# EAGLE design Adafruit QT2040 Trinkey (EAGLE 9.6.2)
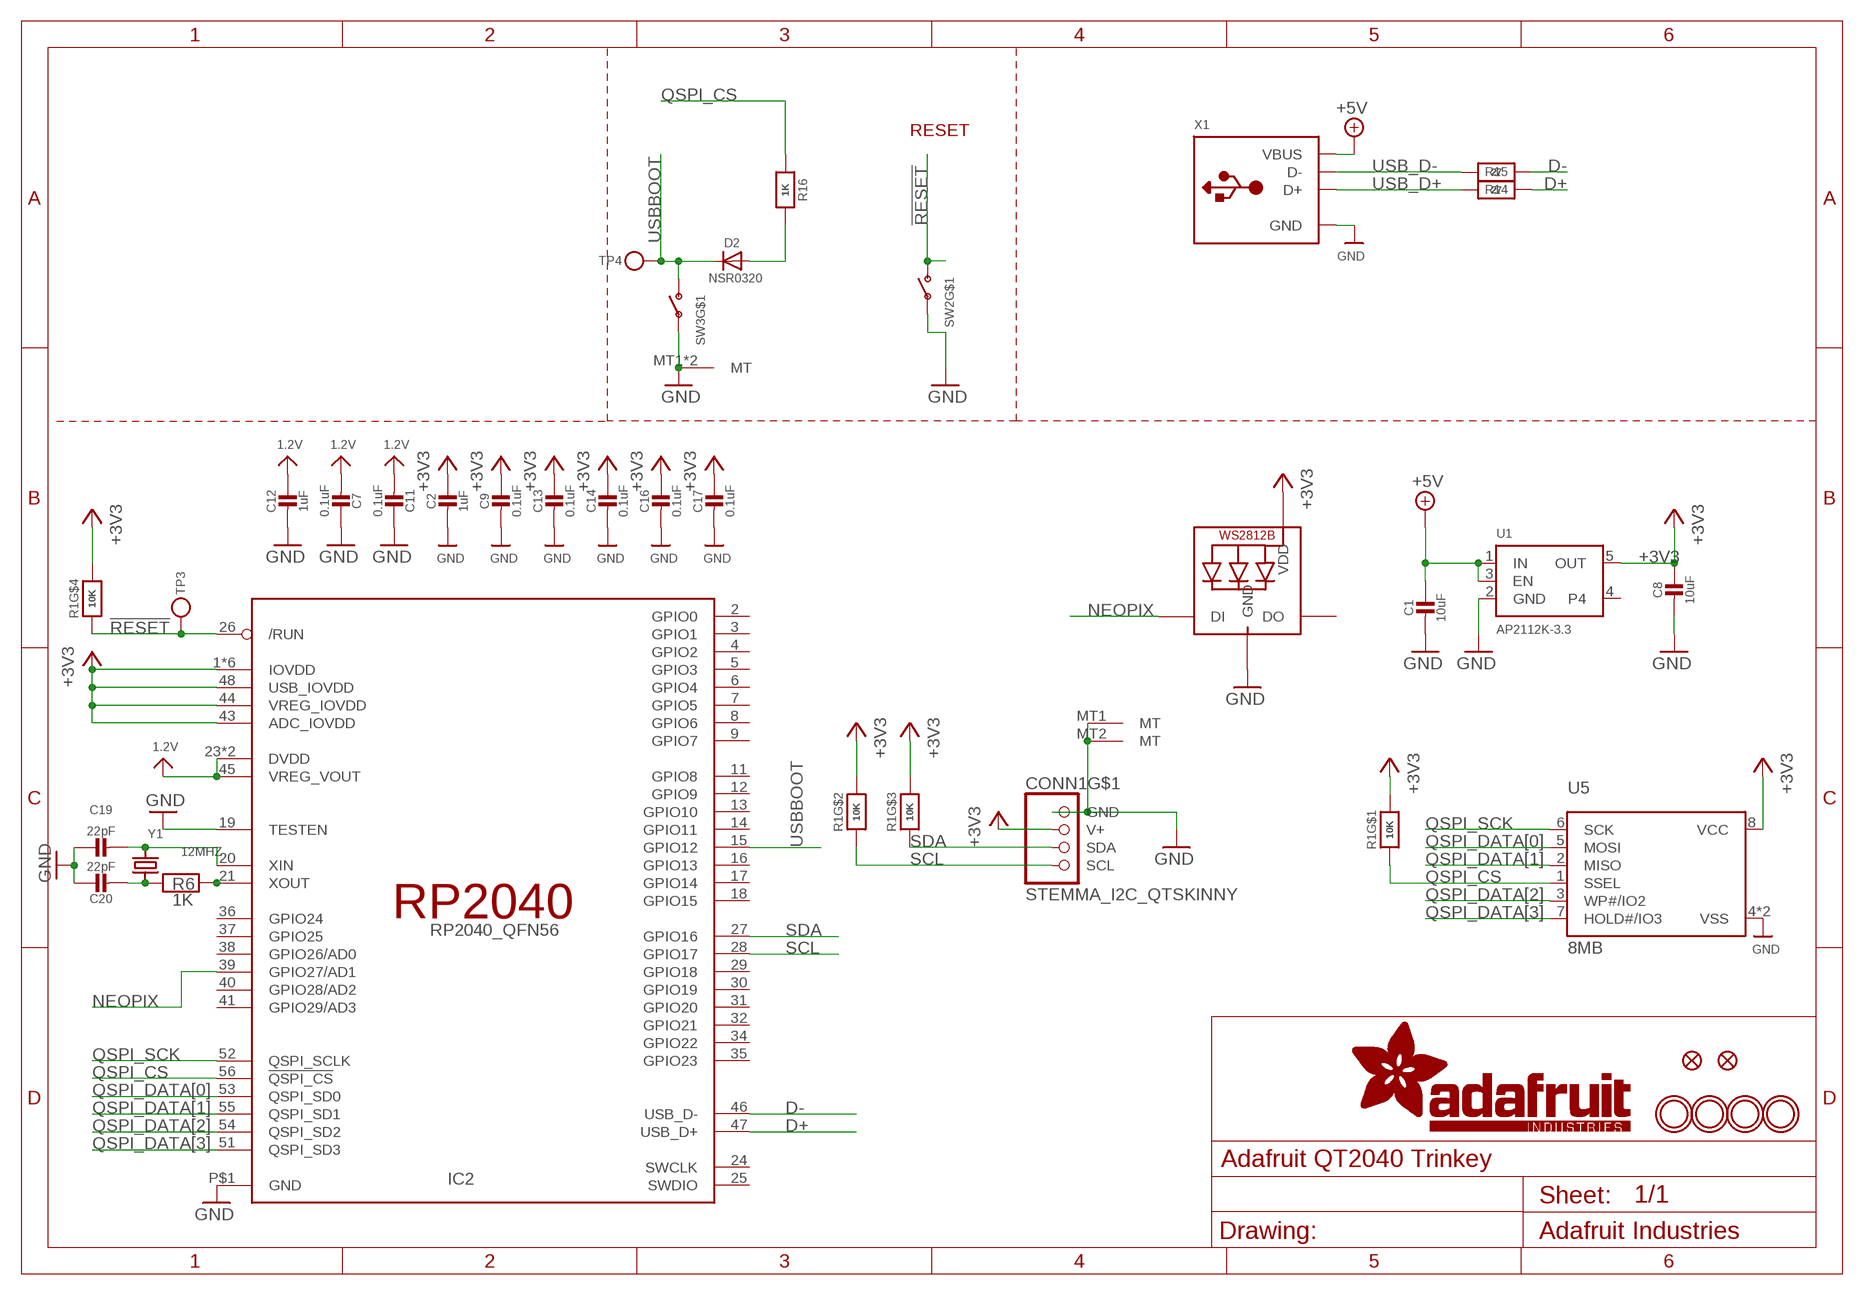
[diagram p0: schematic, sheet 1]

## Parts
C1  10uF  CAP_CERAMIC0805-NOOUTLINE  [0805-NO]
C2  1uF  CAP_CERAMIC0603_NO  [0603-NO]
C7  0.1uF  CAP_CERAMIC_0603MP  [_0603MP]
C8  10uF  CAP_CERAMIC0805-NOOUTLINE  [0805-NO]
C9  0.1uF  CAP_CERAMIC0603_NO  [0603-NO]
C11  0.1uF  CAP_CERAMIC0603_NO  [0603-NO]
C12  1uF  CAP_CERAMIC0603_NO  [0603-NO]
C13  0.1uF  CAP_CERAMIC0603_NO  [0603-NO]
C14  0.1uF  CAP_CERAMIC0603_NO  [0603-NO]
C16  0.1uF  CAP_CERAMIC0603_NO  [0603-NO]
C17  0.1uF  CAP_CERAMIC0603_NO  [0603-NO]
C19  22pF  CAP_CERAMIC0603_NO  [0603-NO]
C20  22pF  CAP_CERAMIC0603_NO  [0603-NO]
CONN1  STEMMA_I2C_QTSKINNY  [JST_SH4_SKINNY]
D2  NSR0320  DIODE_SOD323MINI  [SOD-323_MINI]
IC2  RP2040_QFN56  [QFN56_7MM_REDUCEDEPAD]
LED1  WS2812B_SK6805_1515  [SK6805_1515]
R1  10K  RESISTOR_4PACK  [RESPACK_4X0603]
R6  1K  RESISTOR_0603_NOOUT  [0603-NO]
R14  27  RESISTOR_0603_NOOUT  [0603-NO]
R15  27  RESISTOR_0603_NOOUT  [0603-NO]
R16  1K  RESISTOR_0603_NOOUT  [0603-NO]
SW2  SWITCH_SPST_TACT_RA  [SPST_TACTILE_RA]
SW3  SWITCH_SPST_TACT_RA  [SPST_TACTILE_RA]
TP3  TESTPOINTROUND1.5MMNO  [TESTPOINT_ROUND_1.5MM_NO]
TP4  TESTPOINTROUND1.5MMNO  [TESTPOINT_ROUND_1.5MM_NO]
U1  AP2112K-3.3  VREG_SOT23-5  [SOT23-5]
U5  8MB  SPIFLASH_8PIN_4X4  [USON8_4X4]
U$1  MOUNTINGHOLE2.5  [MOUNTINGHOLE_2.5_PLATED]
U$2  MOUNTINGHOLE2.5  [MOUNTINGHOLE_2.5_PLATED]
U$4  MOUNTINGHOLE2.5  [MOUNTINGHOLE_2.5_PLATED]
U$5  MOUNTINGHOLE2.5  [MOUNTINGHOLE_2.5_PLATED]
U$6  FIDUCIAL_1MM  [FIDUCIAL_1MM]
U$8  FIDUCIAL_1MM  [FIDUCIAL_1MM]
X1  USB_TYPEAPCB  [USBA_PCB]
Y1  12MHZ  CRYSTAL2.5X2.0  [CRYSTAL_2.5X2]

## Nets
1.2V: C7.2 C11.2 C12.1 IC2.23(DVDD) IC2.45(VREG_VOUT) IC2.50(DVDD)
!RESET: IC2.26(/RUN) R1.4 SW2.2(S) TP3.P$1
+3V3: C2.1 C8.1 C9.1 C13.1 C14.1 C16.1 C17.1 CONN1.2(V+) IC2.1(IOVDD) IC2.10(IOVDD) IC2.22(IOVDD) IC2.33(IOVDD) IC2.42(IOVDD) IC2.43(ADC_IOVDD) IC2.44(VREG_IOVDD) IC2.48(USB_IOVDD) IC2.49(IOVDD) LED1.2(VDD) R1.5 R1.6 R1.7 R1.8 U1.5(OUT) U5.8(VCC)
+5V [power]: C1.1 U1.1(IN) U1.3(EN) X1.VCC(VBUS)
D+: IC2.47(USB_D+) R15.2
D-: IC2.46(USB_D-) R14.2
GND [power]: C1.2 C2.2 C7.1 C8.2 C9.2 C11.1 C12.2 C13.2 C14.2 C16.2 C17.2 C19.1 C20.1 CONN1.1(GND) CONN1.MT1(MT) CONN1.MT2(MT) IC2.19(TESTEN) IC2.P$1(GND) LED1.4(GND) SW2.1(P) SW3.1(P) SW3.MT1(MT) SW3.MT2(MT) U1.2(GND) U5.4(VSS) U5.PAD(VSS) X1.GND
N$1: D2.A R16.2
N$5: C19.2 IC2.20(XIN) Y1.3
N$6: C20.2 R6.1 Y1.1
N$7: IC2.21(XOUT) R6.2
NEOPIX: IC2.39(GPIO27/AD1) LED1.1(DI)
QSPI_CS: IC2.56(!QSPI_CS) R1.1 R16.1 U5.1(SSEL)
QSPI_DATA[0]: IC2.53(QSPI_SD0) U5.5(MOSI)
QSPI_DATA[1]: IC2.55(QSPI_SD1) U5.2(MISO)
QSPI_DATA[2]: IC2.54(QSPI_SD2) U5.3(WP#/IO2)
QSPI_DATA[3]: IC2.51(QSPI_SD3) U5.7(HOLD#/IO3)
QSPI_SCK: IC2.52(QSPI_SCLK) U5.6(SCK)
SCL: CONN1.4(SCL) IC2.28(GPIO17) R1.2
SDA: CONN1.3(SDA) IC2.27(GPIO16) R1.3
USB_D+: R15.1 X1.USB_PLUS(D+)
USB_D-: R14.1 X1.USB_NEG(D-)
USBBOOT: D2.C IC2.15(GPIO12) SW3.2(S) TP4.P$1
Unconnected: IC2.2(GPIO0) IC2.3(GPIO1) IC2.4(GPIO2) IC2.5(GPIO3) IC2.6(GPIO4) IC2.7(GPIO5) IC2.8(GPIO6) IC2.9(GPIO7) IC2.11(GPIO8) IC2.12(GPIO9) IC2.13(GPIO10) IC2.14(GPIO11) IC2.16(GPIO13) IC2.17(GPIO14) IC2.18(GPIO15) IC2.24(SWCLK) IC2.25(SWDIO) IC2.29(GPIO18) IC2.30(GPIO19) IC2.31(GPIO20) IC2.32(GPIO21) IC2.34(GPIO22) IC2.35(GPIO23) IC2.36(GPIO24) IC2.37(GPIO25) IC2.38(GPIO26/AD0) IC2.40(GPIO28/AD2) IC2.41(GPIO29/AD3) LED1.3(DO) SW2.MT1(MT) SW2.MT2(MT) U1.4

## Notes on the sheet
- RESET

## Library data of the parts
C1 C2 C7-C9 C11-C14 C16 C17 C19 C20 = microbuilder:CAP_CERAMIC: Ceramic Capacitors For new designs, use the packages preceded by an '_' character since they are more reliable: The following footprints should be used on most boards: _0402 - Standard footprint for regular board layouts _0603 - Standard footprint for regular board layouts _0805 - Standard footprint for regular board layouts _1206 - Standard footprint for regular board layouts For extremely tight-pitch boards where space is at a premium, the following 'micro-pitch' footprints can be used (smaller pads, no silkscreen outline, etc.): _0402MP - Micro-pitch footprint for very dense/compact boards _0603MP - Micro-pitch footprint for very dense/compact boards _0805MP - Micro-pitch footprint for very dense/compact boards _1206MP - Micro-pitch footprint for very dense/compact boards
CONN1 = microbuilder:STEMMA_I2C
D2 = microbuilder:DIODE: Diode SMA Model Volts Amps Type Vf Ir Digikey # Notes SSA34-E3 40V 3A Schottky 480mV @ 3A 200uA @ 40V SSA34-E3/61TGITR-ND CDBA120-G 20V 1A Schottky 500mV @ 1A 500uA @ 20V 641-1014-6-ND REEL MBRA210 10V 2A Schottky 350mV @ 2A 700uA @ 10V MBRA210LT3 SOD-123 Model Volts Amps Type Vf Ir Order # Notes BAT54T1G 30V 200mA Schottky 800mV @ 200mA 2uA @ 25V BAT54T1GOSTR-ND B0530W 30V 500mA Schottky 430mV @ 500mA 130uA @ 30V B0530W-FDICT-ND REEL MBR120 20V 1A Schottky 340mV @ 1A MBR120VLSFT1GOSCT-ND SOD-323 Model Volts Amps Type Vf Ir Order # Notes PMEG2005EJ 20V 500mA Schottky 355mV @ 500mA 568-4110-1-ND ZLLS410 10V 570mA Schottky 380mV @ 570mA ZLLS410CT-ND 1N4148WS 75V 150mA Silicon/Simple 1V 1N4148WSFSCT-ND REEL SOD-523 Model Volts Amps Type Vf Ir Order # Notes BAT54XV2 30V 200mA Schottky 0.8V @ 100mA BAT54XV2CT-ND TB751S 30V 30mA Schottky RB751S-40TE61CT-ND SOT23-R/W (R = Solder Paste/Reflow Ovens, W = Hand-Soldering) Model Volts Amps Type Vf Ir Order # Notes BAT54FILM 40V 300mA Schottky 497-7162-1-ND POWERDI-5 Model Volts Amps Type Vf Ir Order # Notes PDS560 60V 5A Schottky 670mV @ 5A 150uA @ 60V PDS560DICT-ND
IC2 = adafruit_micro:RP2040
LED1 = microbuilder:WS2812B
R1 = microbuilder:RESISTOR_4PACK: Resistor Packs (4 resistors) 4 x 0603 10K 1/16W - Digikey: YC164J-10KCT-ND
R6 R14-R16 = microbuilder:RESISTOR: Resistors For new designs, use the packages preceded by an '_' character since they are more reliable: The following footprints should be used on most boards: _0402 - Standard footprint for regular board layouts _0603 - Standard footprint for regular board layouts _0805 - Standard footprint for regular board layouts _1206 - Standard footprint for regular board layouts For extremely tight-pitch boards where space is at a premium, the following 'micro-pitch' footprints can be used (smaller pads, no silkscreen outline, etc.): _0402MP - Micro-pitch footprint for very dense/compact boards _0603MP - Micro-pitch footprint for very dense/compact boards _0805MP - Micro-pitch footprint for very dense/compact boards _1206MP - Micro-pitch footprint for very dense/compact boards
SW2 SW3 = adafruit_electromech:SWITCH_SPST: Switch - SPST 4UCon 19192 (6.7x2.6mm SMT)
TP3 TP4 = microbuilder:TESTPOINT: Test Point Various test points for characterisation and PCB testing TESTPOINT_SMT - Compact Surface Mount Test Point [Digikey: 5016KTR-ND]
U1 = adafruit_power:VREG_SOT23-5: SOT23-5 Fixed Voltage Regulators Part Current Out V Out V In V Dropout θJA (°C/W) TJ (°C) Digikey Part No. ADP121 150mA 3.3V 3.4-5.5V 0.09V @ 150mA -- -- ADP121-AUJZ33R7CT-ND ADP121 150mA 3.0V 3.1-5.5V 0.09V @ 150mA -- -- ADP121-AUJZ30R7CT-ND ADP122 300mA 3.3V 3.4-5.5V 0.085V @ 300mA -- -- ADP122AUJZ-3.3-R7CT-ND ADP1712 300mA 3.3V 3.5-5.5V 0.17V @ 300mA -- -- ADP1712AUJZ-3.3-R7TR-ND AP7311 (Low Cost) 150mA 3.3V 3.5-6V 0.15V @ 150mA -- -- AP7311-33WG-7DICT-ND LD39015M18R 150mA 1.8V 1.9V-5.5V 0.08V @ 100mA -- -- 497-6977-1-ND LP2985A-33DBVR 150mA 3.3V 3.3-16V 0.28V @ 150mA 206 150 296-18479-1-ND MCP1824T-3302E/OT 300mA 3.3V 3.5V-6V 0.2V @ 300mA -- -- MCP1824T-3302E/OTCT-ND MIC5205-2.5YM5 TR 150mA 2.5V 2.7-16V 0.165V @ 150mA -- -- 576-1257-2-ND MIC5205-3.0YM5 TR 150mA 3.0V 3.2V-16V 0.165V @ 150mA -- -- 576-1258-2-ND MIC5205-3.3YM5 TR 150mA 3.3V 3.5V-16V 0.165V @ 150mA -- -- 576-1259-2-ND TPS780330220 150mA 3.3V+2.2V 3.6-5.5V 250mV Max -- -- 296-23332-1-ND TDA3663/N1,135 100mA 3.3V 3.5-45V 0.18V @ 50mA -- -- 568-5343-1-ND Max operating temp can be calculated using θJA, TJ (max junction temperature), and power in watts. Set the "Maximum Ambient Temperature" until it reaches TJ ("Max Junction Temperature"), which is the absolute limit for safe use of the regulator: Heat Sink Temperature Calculator <http://www.daycounter.com/Calculators/Heat-Sink-Temperature-Calculator.phtml> For example, With 12V source into a 3.3V LP2985 and a 30mA load, we are dissipating (12V-3.3V) * 0.03A = 0.261W. With a θJA of 206 °C/W, a TJ of 150°C, and 261mW we can safely use the chip without a heat sink up to 75°C (=147.1°C Junction Temperature).
U5 = microbuilder:SPIFLASH_8PIN: SOIC8 SPI Flash Be careful with the size since SOIC8 flash comes in several 'widths' SOIC8 150 mil M25P16 - 16Mbit (2Mbit x 8) Serial Flash (75MHz SPI Bus), Supply: 2.7-3.6V Digikey: SOIC8 - M25P16-VMN6P-ND SOIC8 208 mil W25Q16BVSSIG - 16Mbit (2Mbit x 8) Serial Flash (104MHz SPI Bus), Supply: 2.7-3.6V Digikey: SOIC8 - W25Q16BVSSIG-ND
U$1 U$2 U$4 U$5 = adafruit_electromech:MOUNTINGHOLE: Mounting Hole For #2 screws (0.086"/2.18mm width, 0.094"/2.4mm hole) use 2.5mm; BOM: EXCLUDE
U$6 U$8 = microbuilder:FIDUCIAL: Fiducial Alignment Points Various fiducial points for machine vision alignment.; BOM: EXCLUDE
X1 = adafruit_electromech:USB_TYPEA: USB - Type A Connectors Male types stick out and are inserted into a PC or matching females parts (these are the connectors used on USB Memory Sticks, etc.). Female parts are generally used for USB Host and accept a male-type connector. SMT - 4UCON: 10017 PTHFML - Digikey: 609-1045-ND, 4UCon: 05241 PCB - Use 2.0mm thick PCBs with this footprint
Y1 = microbuilder:CRYSTAL: Crystals HC49UP - Surface Mount Crystal 4.0MHz 18pF +/-30ppm Surface Mount Crystal [Digikey: 535-9857-1-ND] 12.0 MHz Surface Mount Crystal [Digikey: 535-9869-6-ND] 25.0 MHz Surface Mount Crystal [Digikey: 535-9078-1-ND] 2.5 x 2.0mm - MEMs SMT Crystal 16.0 MHz 10pF 20ppm 2.5 x 2.0mm Crystal [Digikey -40-85°C: 535-10923-1-ND] 3.2 x 2.5mm - MEMs SMT Crystal 12.0 MHz 8pF 15ppm 3.2 x 2.5mm Crystal [Digikey: -10-70°C: 644-1047-1-ND -40-125°C: 644-1128-1-ND] 40~85°C cheaper: 644-1173-6-ND 16.0 MHz 8pF 15ppm 3.2 x 2.5mm Crystal [Digikey: -10-70°C: 644-1049-1-ND -40-125°C: 644-1129-2-ND]-40~85°C cheaper: 644-1175-6-ND 16.0 MHz 10pF 10ppm 3.2 x 2.5mm Crystal [Digikey: 644-1100-1-ND] 27.12 MHz 18pF 30ppm 3.2 x 2.5mm Crystal [Digikey: 887-1424-1-ND] 27.12MHz 10pF 10ppm 3.2 x 2.5mm Crystal [Digikey: 887-1329-1-ND] 4.9 x 1.8mm - MEMs SMT Crystal 32.768 KHz 12.5pF 20ppm 4.9 x 1.8mm Crystal [Digikey: SE2415CT-ND] 8.0 x 3.8mm - Surface Mount Crystal 32.768kHz 12.5pF 20ppm -40°C-85°C [Digikey: 535-9166-2-ND] Cylinder 32.768KHz Cylinder Crystal (2x6mm body) [Ex. Digikey: 300-8341-2-ND]

## Net classes
1 power: width 0.305 mm
2 gnd: width 0.254 mm

## Board
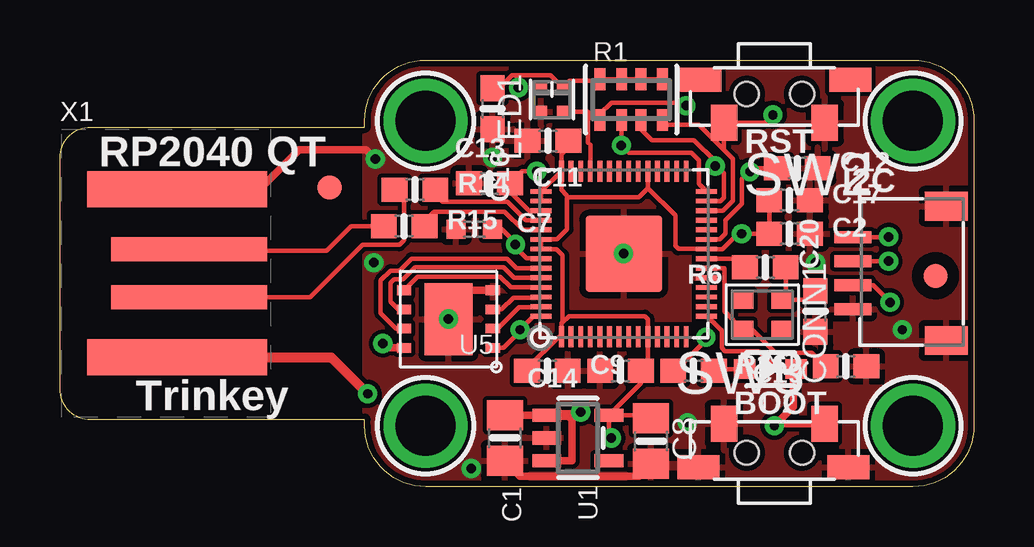
[diagram p1: board, top side]
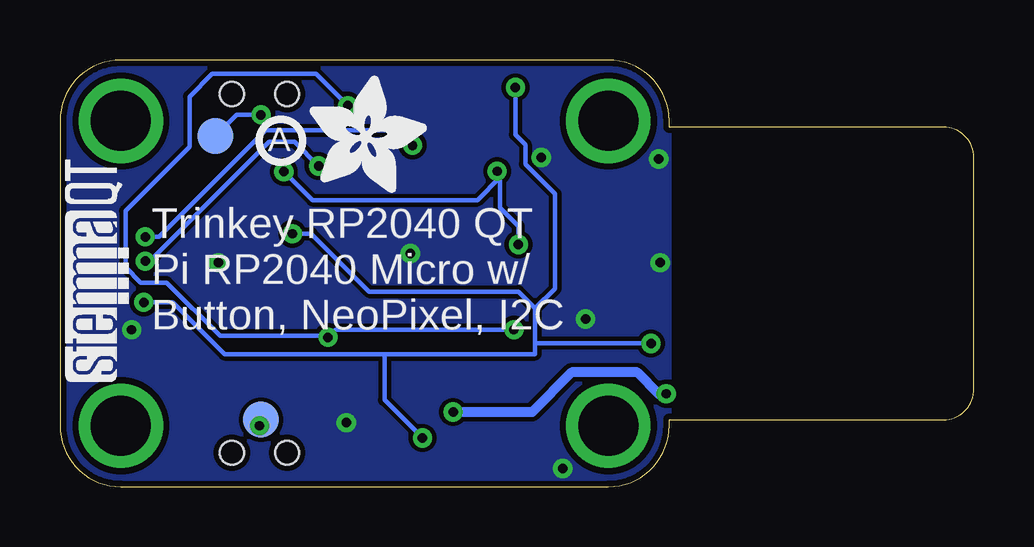
[diagram p2: board, bottom side, seen from below]

Size 38.1 x 17.78 mm. Coordinates in mm from the lower left corner, seen from the top.
Outline: 15.24,17.78 35.56,17.78 arc-90 38.1,15.24 38.1,2.54 arc-90 35.56,0 15.24,0 arc-90 12.7,2.54 12.7,2.79 1.27,2.79 arc-90 0,4.06 0,13.72 arc-90 1.27,14.99 12.7,14.99 12.7,15.24 arc-90 15.24,17.78
Copper layers (1*16): Top 0.035mm / dielectric 1.5mm / Bottom 0.035mm
Design rules "adafruit 7-7": minimum track width 7mil, minimum drill 15.5mil, track to track 7mil, track to pad 7mil, pad to pad 7mil, via to via 7mil, smd to smd 7mil, copper to edge 10mil, drill to drill 8mil, minimum pad ring 10mil, minimum via ring 8mil, stop-mask expansion 2mil, vias tented up to drill 20mil, thermal gap 10mil

### Footprints (pad centres in the part's own frame; a part is rotated, then mirrored left to right if it is on the bottom)
0805-NO = smd 1.24 x 1.5: 1 -0.95,0; 2 0.95,0
0603-NO = smd 1.075 x 1: 1 -0.85,0; 2 0.85,0
_0603MP = smd 0.8 x 0.8: 1 -0.762,0; 2 0.762,0
JST_SH4_SKINNY = smd 0.5 x 1.55: 1 -1.5,2.514; 2 -0.5,2.514; 3 0.5,2.514; 4 1.5,2.514 | smd 1.2 x 1.8: MT1 -2.8,-1.386; MT2 2.8,-1.386
SOD-323_MINI = smd 0.9 x 0.8: A 1.07,0; C -1.07,0
QFN56_7MM_REDUCEDEPAD = smd 0.875 x 0.2: 1 -3.45,2.6; 2 -3.45,2.2; 3 -3.45,1.8; 4 -3.45,1.4; 5 -3.45,1; 6 -3.45,0.6; 7 -3.45,0.2; 8 -3.45,-0.2; 9 -3.45,-0.6; 10 -3.45,-1; 11 -3.45,-1.4; 12 -3.45,-1.8; 13 -3.45,-2.2; 14 -3.45,-2.6; 29 3.45,-2.6; 30 3.45,-2.2; 31 3.45,-1.8; 32 3.45,-1.4; 33 3.45,-1; 34 3.45,-0.6; 35 3.45,-0.2; 36 3.45,0.2; 37 3.45,0.6; 38 3.45,1; 39 3.45,1.4; 40 3.45,1.8; 41 3.45,2.2; 42 3.45,2.6 | smd 0.2 x 0.875: 15 -2.6,-3.45; 16 -2.2,-3.45; 17 -1.8,-3.45; 18 -1.4,-3.45; 19 -1,-3.45; 20 -0.6,-3.45; 21 -0.2,-3.45; 22 0.2,-3.45; 23 0.6,-3.45; 24 1,-3.45; 25 1.4,-3.45; 26 1.8,-3.45; 27 2.2,-3.45; 28 2.6,-3.45; 43 2.6,3.45; 44 2.2,3.45; 45 1.8,3.45; 46 1.4,3.45; 47 1,3.45; 48 0.6,3.45; 49 0.2,3.45; 50 -0.2,3.45; 51 -0.6,3.45; 52 -1,3.45; 53 -1.4,3.45; 54 -1.8,3.45; 55 -2.2,3.45; 56 -2.6,3.45 | smd 3.2 x 3.2: P$1 0,0
SK6805_1515 = smd 0.5 x 0.5: 1 -0.5,-0.45; 2 0.5,-0.45; 3 0.5,0.45; 4 -0.5,0.45
RESPACK_4X0603 = smd 0.45 x 0.9: 1 -1.3,-0.85; 2 -0.4,-0.85; 3 0.4,-0.85; 4 1.3,-0.85; 5 1.3,0.85; 6 0.4,0.85; 7 -0.4,0.85; 8 -1.3,0.85
SPST_TACTILE_RA = smd 1.1 x 1.5: 1 -2.1,0.9; 2 2.1,0.9 | smd 1.75 x 1: MT1 -3.175,-0.9; MT2 3.075,-0.9 | hole 1: -1.15,-0.3; 1.15,-0.3
TESTPOINT_ROUND_1.5MM_NO = smd 1.5 x 1.5: P$1 0,0
SOT23-5 = smd 0.55 x 1.2: 1 -0.95,-1.3; 2 0,-1.3; 3 0.95,-1.3; 4 0.95,1.3; 5 -0.95,1.3
USON8_4X4 = smd 0.6 x 0.4: 1 -1.85,1.2; 2 -1.85,0.4; 3 -1.85,-0.4; 4 -1.85,-1.2; 5 1.85,-1.2; 6 1.85,-0.4; 7 1.85,0.4; 8 1.85,1.2 | smd 2 x 3: PAD 0,0
MOUNTINGHOLE_2.5_PLATED = drill 2.5 pad 3.2: P$1 0,0
FIDUCIAL_1MM = smd 1 x 1: 1 0,0
USBA_PCB = smd 7.5 x 1.5: GND -0.2,3.5; VCC -0.2,-3.5 | smd 6.5 x 1: USB_NEG 0.3,-1; USB_PLUS 0.3,1
CRYSTAL_2.5X2 = smd 0.9 x 0.75: 1 -0.825,-0.625; 2 0.825,-0.625; 3 0.825,0.625; 4 -0.825,0.625

### Placement (x,y rotation side)
C1  18.54,2.03 270 top
C2  30.42,10.54 0 top
C7  17.27,10.73 0 top
C8  24.64,1.91 270 top
C9  20.32,4.83 0 top
C11  17.91,12.64 0 top
C12  30.73,13.27 0 top
C13  20.35,14.41 180 top
C14  23.37,4.83 180 top
C16  18.03,15.75 270 top
C17  30.42,11.94 0 top
C19  32.77,5.02 180 top
C20  31.5,7.3 90 top
CONN1  35.56,8.89 90 top
D2  29.62,4.9 180 top
IC2  23.51,9.7 90 top
LED1  20.51,16.13 90 top
R1  23.81,16.13 0 top
R6  29.4,9.14 180 top
R14  14.8,12.38 0 top
R15  14.35,10.86 0 top
R16  26.42,4.83 0 top
SW2  29.78,16.07 180 top
SW3  29.78,1.71 0 top
TP3  31.62,14.61 270 bottom
TP4  29.72,2.79 270 bottom
U1  21.59,2.03 270 top
U5  16.19,6.99 180 top
U$1  15.24,15.24 0 top
U$2  15.24,2.54 0 top
U$4  35.56,2.54 0 top
U$5  35.56,15.24 0 top
U$6  36.5,8.79 270 top
U$7  [STEMMAQT]  35.24,4.38 90 bottom
U$8  11.24,12.46 90 top
U$9  [PCBFEAT-REV-040]  28.89,14.41 0 bottom
U$10  [ADAFRUIT_5MM]  27.69,12.26 0 bottom
X1  5.08,8.89 0 top
Y1  29.27,7.18 180 top

### Tracks (layer width: path | path; a pad name or v marks a point on that pad's centre or on a via)
1.2V  (via drill 0.39)
  Top 0.178: C7.2 18.42,10.73 18.99,10.17 v18.99,10.1 18.99,9.98 19.44,9.53 20.04,9.53 IC2.50 | IC2.45 19.55,11.5 19.54,11.5 18.76,12.28 C11.2 19.27,13.14 v19.88,13.14 | IC2.23 27.52,10.3 27.75,10.53 27.75,11.11 28.42,11.79 28.42,12.83 28.87,13.27 C12.1 28.91,13.27 v28.77,13.12
  Bottom 0.178: v28.77,13.12 27.58,11.94 20.7,11.94 19.75,12.89 | v19.88,13.14 19.75,13.27 19.75,12.89 | v18.99,10.1 18.99,10.86 19.75,11.62 19.75,12.89
!RESET  (via drill 0.39)
  Top 0.178: 27.68,14.04 26.64,15.09 25.3,15.09 R1.4 | IC2.26 27.63,11.5 28.05,11.92 28.05,13.61 28.05,13.67 27.68,14.04 | 27.68,14.04 SW2.2 29.39,15.17 v29.72,15.49
  Bottom 0.178: v29.72,15.49 30.73,15.49 TP3.P$1
+3V3  (via drill 0.39)
  Top 0.178: IC2.44 IC2.43 IC2.42 | IC2.33 24.51,12.45 | IC2.42 20.91,12.37 21.15,12.13 | 24.51,12.45 24.13,12.07 21.21,12.07 21.15,12.13 | R1.5 R1.6 R1.7 R1.8 22.45,16.91 21.25,16.91 LED1.2 20.45,17.15 18.99,17.15 | U1.5 24.22,4.31 C14.1 24.41,4.83 24.51,4.92 IC2.10 24.51,6.99 24.38,7.11 21.21,7.11 20.91,6.81 IC2.1 20.79,6.25 19.47,4.93 C9.1 | U1.5 24.51,2.98 C8.1 | 20.95,6.86 20.95,9.65 20.7,9.9 IC2.49 IC2.48 20.72,10.3 21.14,10.73 21.14,12.13 21.15,12.13 | 24.51,12.45 25.65,11.3 25.65,10.03 25.78,9.91 IC2.22 27.62,9.9 28.26,10.54 v28.42,10.54 C2.1 C17.1 | CONN1.2 33.9,8.39 v34.61,7.68 | v22.99,2.03 22.89,2.03 U1.5 | IC2.42 20.91,13.86 21.2,14.15 C13.1 | C16.1 18.31,16.6 18.85,17.15 18.99,17.15 | 18.99,17.15 19.11,17.02 v19.11,16.64
  Top 0.305: U5.8 13.65,5.79 v13.46,5.97
  Bottom 0.178: v34.61,7.68 33.4,7.68 31.24,5.53 24.57,5.53 | 24.57,5.53 18.29,5.53 18.29,5.97 | v13.46,5.97 18.29,5.97 | v28.42,10.54 27.62,10.54 25.21,8.13 18.99,8.13 18.29,7.43 | 18.29,7.43 18.29,5.97 | 24.57,5.53 24.57,3.62 v22.99,2.03 | v19.11,16.64 19.11,14.67 18.7,14.26 18.7,13.44 17.46,12.2 17.46,8.26 18.29,7.43
+5V  (via drill 0.39)
  Top 0.305: C1.1 U1.1 20.89,2.98 21.15,2.98 21.34,2.79 21.34,1.08 U1.3
  Top 0.406: X1.VCC 11.31,5.39 v12.83,3.87 | v21.71,3.11 21.58,2.98 20.89,2.98
  Bottom 0.406: v12.83,3.87 13.14,3.87 14.03,4.76 16.77,4.76 18.41,3.11 v21.71,3.11
D+
  Top 0.178: IC2.47 19.3,10.7 18.53,11.46 15.59,11.46 15.2,11.07 R15.2
D-
  Top 0.178: IC2.46 19.42,11.1 18.66,11.87 15.94,11.87 15.62,12.26 R14.2
GND  (via drill 0.39)
  Top 0.305: v13.14,13.65 12.76,14.03 9.97,14.03 8.33,12.39 X1.GND | C1.2 19.18,0.45 24.13,0.45 C8.2 | U5.4 16.57,8.19 16.19,7.81 U5.PAD
  other vias: 23.49,9.72 26.16,2.67 35.12,6.54 18.03,13.72 17.14,0.76 31.5,9.33 16.19,6.99 13.08,9.33
  pour Top: 12.7,17.78 38.1,17.78 38.1,0 12.7,0
  pour Bottom: 12.7,17.78 38.1,17.78 38.1,0 12.7,0
N$1
  Top 0.178: R16.2 27.34,4.9 D2.A
N$5
  Top 0.178: IC2.20 27.7,9.1 27.7,7.3 Y1.3 28.86,6.55 29.82,5.59 31.34,5.59 C19.2
N$6
  Top 0.178: R6.1 30.25,7.95 Y1.1 31.14,7.8 C20.2
N$7
  Top 0.178: IC2.21 28.19,9.5 R6.2
NEOPIX
  Top 0.178: LED1.1 22.02,15.63 22.02,14.34 22.11,14.25 IC2.39
QSPI_CS  (via drill 0.39)
  Top 0.178: IC2.56 19.74,7.1 v19.18,6.54 19.18,6.48 18.49,5.79 U5.1 | v26.92,6.22 26.92,6.1 25.65,4.83 | R1.1 22.51,15.53 22.98,16 25.97,16 v26.1,15.88 | R16.1 25.65,4.83 | 25.65,4.83
  Bottom 0.178: v19.18,6.54 26.61,6.54 v26.92,6.22 26.99,6.29 31.43,6.29 33.66,8.51 34.73,8.51 35.37,9.14 35.37,11.49 32.7,14.16 32.7,16.26 31.75,17.21 27.43,17.21 v26.1,15.88
QSPI_DATA[0]
  Top 0.178: IC2.53 18.8,8.3 18.35,8.75 14.91,8.75 U5.5
QSPI_DATA[1]
  Top 0.178: IC2.55 20.02,7.47 19.13,7.47 18.24,6.59 U5.2
QSPI_DATA[2]
  Top 0.178: IC2.54 20.02,7.87 18.9,7.87 18.41,7.39 U5.3
QSPI_DATA[3]
  Top 0.178: U5.7 14.01,6.59 13.37,7.22 13.37,8.61 13.77,9.01 14.16,9.01 14.65,9.5 18.63,9.5 19.02,9.11 IC2.51
QSPI_SCK
  Top 0.178: U5.6 14.1,7.39 13.78,7.71 13.78,8.5 13.93,8.65 14.3,8.65 14.79,9.14 18.48,9.14 18.92,8.7 IC2.52
SCL  (via drill 0.39)
  Top 0.178: IC2.28 26.63,12.63 26.63,13.6 26.32,13.91 23.72,13.91 v23.4,14.22 23.4,15.04 23.41,15.03 R1.2 | v34.54,10.41 34.52,10.39 CONN1.4
  Bottom 0.178: v23.4,14.22 23.72,14.22 24.34,14.85 29.54,14.85 33.97,10.41 v34.54,10.41
SDA  (via drill 0.39)
  Top 0.178: IC2.27 27.53,11.9 27.67,12.04 27.67,13.07 27.38,13.36 v27.31,13.36 27.31,13.55 26.43,14.44 24.67,14.44 24.21,14.9 R1.3 | CONN1.3 v34.54,9.39 v34.54,9.4
  Bottom 0.178: v34.54,9.4 34.35,9.4 29.39,14.36 28.32,14.36 v27.31,13.36
USB_D+
  Top 0.178: R15.1 12.13,10.86 11.11,9.84 7.05,9.84 6.98,9.91 5.4,9.91 X1.USB_PLUS
USB_D-
  Top 0.178: R14.1 14.35,11.98 14.35,10.28 14.15,10.07 12.62,10.07 10.43,7.89 X1.USB_NEG
USBBOOT  (via drill 0.39)
  Top 0.178: 30.57,4.79 D2.C 30.61,4.98 29.8,4.98 29.13,5.65 27.73,5.65 27.59,5.79 27.59,6.5 27.2,6.89 27.17,6.89 IC2.15
  Top 0.305: SW3.2 29.86,2.61 v29.78,2.54 30.57,3.33 30.57,4.79
  Bottom 0.178: TP4.P$1 29.78,2.73 v29.78,2.54

### Text on the board
tPlace: RST | RP2040 QT | I2C | Trinkey | BOOT
bPlace: Trinkey RP2040 QT / Pi RP2040 Micro w/ / Button, NeoPixel, I2C